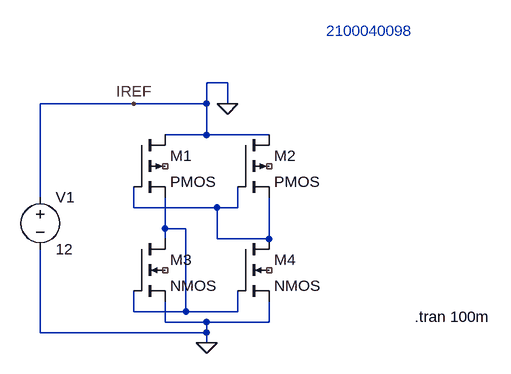
[diagram p0: schematic Current Mirror Circuit..asc]
Current Mirror Circuit..asc, the LTspice schematic file:
Version 4
SHEET 1 880 680
WIRE 224 -32 192 -32
WIRE 80 0 -64 0
WIRE 192 0 192 -32
WIRE 192 0 80 0
WIRE 224 0 224 -32
WIRE 192 48 192 0
WIRE 192 48 128 48
WIRE 288 48 192 48
WIRE -64 144 -64 0
WIRE 80 160 80 128
WIRE 208 160 80 160
WIRE 240 160 240 128
WIRE 240 160 208 160
WIRE 128 192 128 144
WIRE 160 192 128 192
WIRE 128 208 128 192
WIRE 208 208 208 160
WIRE 288 208 288 144
WIRE 288 208 208 208
WIRE 80 320 80 288
WIRE 160 320 160 192
WIRE 160 320 80 320
WIRE 240 320 240 288
WIRE 240 320 160 320
WIRE 128 336 128 304
WIRE 192 336 128 336
WIRE 288 336 288 304
WIRE 288 336 192 336
WIRE -64 352 -64 224
WIRE 192 352 192 336
WIRE 192 352 -64 352
WIRE 192 368 192 352
FLAG 192 368 0
FLAG 224 0 0
FLAG 80 0 IREF
SYMBOL nmos4 80 208 R0
SYMATTR InstName M3
SYMBOL nmos4 240 208 R0
SYMATTR InstName M4
SYMBOL voltage -64 128 R0
WINDOW 123 0 0 Left 0
WINDOW 39 0 0 Left 0
SYMATTR InstName V1
SYMATTR Value 12
SYMBOL pmos4 80 48 R0
SYMATTR InstName M1
SYMBOL pmos4 240 48 R0
SYMATTR InstName M2
TEXT 512 328 Left 2 !.tran 100m
TEXT 376 -112 Left 2 ;2100040098

The netlist it stands for:
* Current Mirror Circuit..asc
M3 N002 N002 0 NC_01 NMOS
M4 N001 N002 0 NC_02 NMOS
V1 0 0 12
M1 0 N001 N002 NC_03 PMOS
M2 0 N001 N001 NC_04 PMOS
.model NMOS NMOS
.model PMOS PMOS
.lib standard.mos
.tran 100m
* 2100040098
.backanno
.end